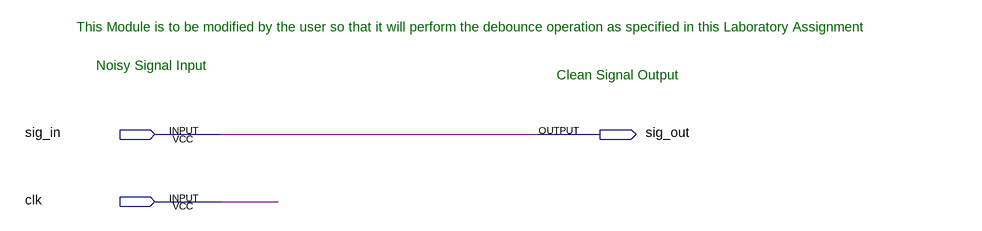
[diagram p0: schematic sheet]
// Quartus schematic debounce.bdf as structural Verilog: 0 symbols, 3 pins
module debounce (
  input  sig_in,
  input  clk,
  output sig_out
);


  assign sig_out = sig_in;

  // Notes on the sheet:
  //   This Module is to be modified by the user so that it will perform the debounce operation as specified in this Laboratory Assignment
  //   Noisy Signal Input
  //   Clean Signal Output
endmodule
